# Altium schematic sheet Test_disposable.SchDoc
size A4; DrawnBy: Philip Rowse
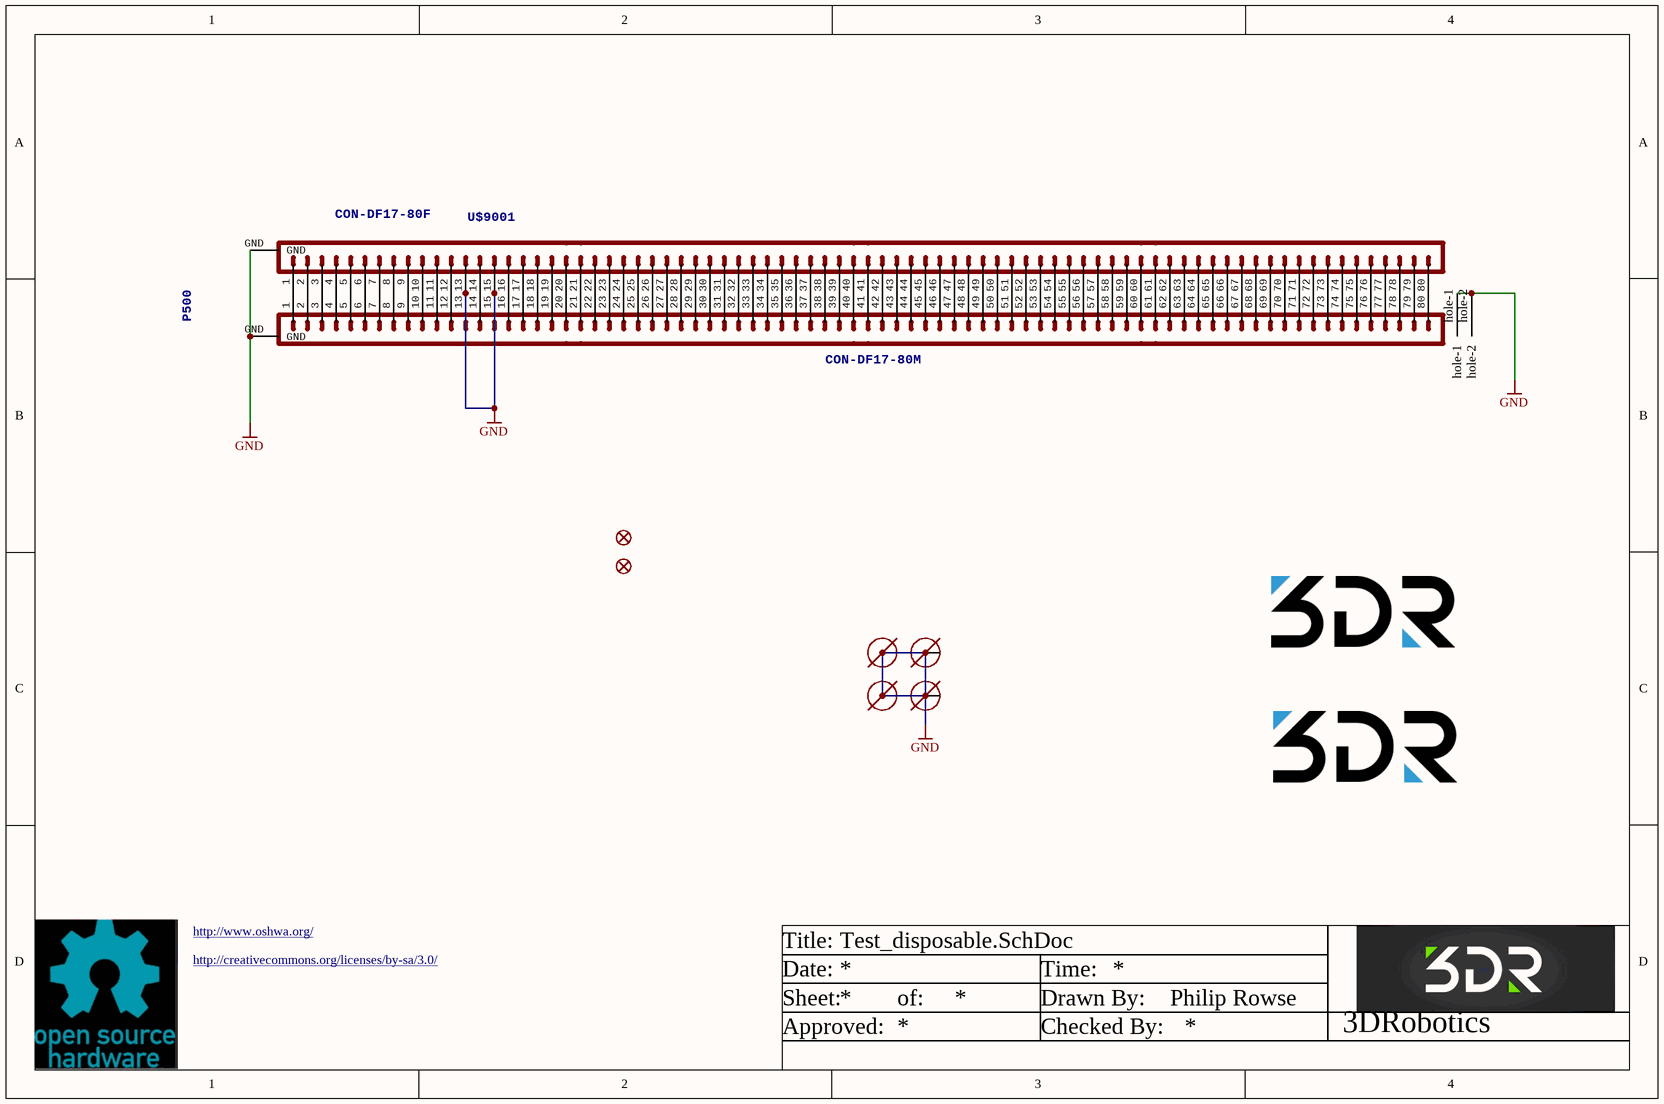
[diagram p0: Test_disposable.SchDoc]

## Parts
3DR_Logo  DO NOT PLACE  [3DR_smaller]  (value not drawn)
3DR_Logo_2  DO NOT PLACE  [3DR_AU]  (value not drawn)
JP400  FIDUCIAL1.5X3  [FIDUCIAL-1.5X3]  (value not drawn)
JP401  FIDUCIAL1.5X3  [FIDUCIAL-1.5X3]  (value not drawn)
M3_MOUNT911  MOUNT-HOLE1.8MM  [MOUNT-HOLE1.8]  (value not drawn)
M3_MOUNT912  MOUNT-HOLE1.8MM  [MOUNT-HOLE1.8]  (value not drawn)
M3_MOUNT913  MOUNT-HOLE1.8MM  [MOUNT-HOLE1.8]  (value not drawn)
M3_MOUNT914  MOUNT-HOLE1.8MM  [MOUNT-HOLE1.8]  (value not drawn)
P500  CON-DF17-80M  [CON-DF17-80M]
U$9001  CON-DF17-80F  [CON-DF17-80F]

## Nets
GND: M3_MOUNT911.1 M3_MOUNT912.1 M3_MOUNT913.1 M3_MOUNT914.1 P500.13 P500.15 P500.GND P500.hole-1 P500.hole-2 U$9001.13 U$9001.15 U$9001.GND
NetP500_1: P500.1 U$9001.1
NetP500_2: P500.2 U$9001.2
NetP500_3: P500.3 U$9001.3
NetP500_4: P500.4 U$9001.4
NetP500_5: P500.5 U$9001.5
NetP500_6: P500.6 U$9001.6
NetP500_7: P500.7 U$9001.7
NetP500_8: P500.8 U$9001.8
NetP500_9: P500.9 U$9001.9
NetP500_10: P500.10 U$9001.10
NetP500_11: P500.11 U$9001.11
NetP500_12: P500.12 U$9001.12
NetP500_14: P500.14 U$9001.14
NetP500_16: P500.16 U$9001.16
NetP500_17: P500.17 U$9001.17
NetP500_18: P500.18 U$9001.18
NetP500_19: P500.19 U$9001.19
NetP500_20: P500.20 U$9001.20
NetP500_21: P500.21 U$9001.21
NetP500_22: P500.22 U$9001.22
NetP500_23: P500.23 U$9001.23
NetP500_24: P500.24 U$9001.24
NetP500_25: P500.25 U$9001.25
NetP500_26: P500.26 U$9001.26
NetP500_27: P500.27 U$9001.27
NetP500_28: P500.28 U$9001.28
NetP500_29: P500.29 U$9001.29
NetP500_30: P500.30 U$9001.30
NetP500_31: P500.31 U$9001.31
NetP500_32: P500.32 U$9001.32
NetP500_33: P500.33 U$9001.33
NetP500_34: P500.34 U$9001.34
NetP500_35: P500.35 U$9001.35
NetP500_36: P500.36 U$9001.36
NetP500_37: P500.37 U$9001.37
NetP500_38: P500.38 U$9001.38
NetP500_39: P500.39 U$9001.39
NetP500_40: P500.40 U$9001.40
NetP500_41: P500.41 U$9001.41
NetP500_42: P500.42 U$9001.42
NetP500_43: P500.43 U$9001.43
NetP500_44: P500.44 U$9001.44
NetP500_45: P500.45 U$9001.45
NetP500_46: P500.46 U$9001.46
NetP500_47: P500.47 U$9001.47
NetP500_48: P500.48 U$9001.48
NetP500_49: P500.49 U$9001.49
NetP500_50: P500.50 U$9001.50
NetP500_51: P500.51 U$9001.51
NetP500_52: P500.52 U$9001.52
NetP500_53: P500.53 U$9001.53
NetP500_54: P500.54 U$9001.54
NetP500_55: P500.55 U$9001.55
NetP500_56: P500.56 U$9001.56
NetP500_57: P500.57 U$9001.57
NetP500_58: P500.58 U$9001.58
NetP500_59: P500.59 U$9001.59
NetP500_60: P500.60 U$9001.60
NetP500_61: P500.61 U$9001.61
NetP500_62: P500.62 U$9001.62
NetP500_63: P500.63 U$9001.63
NetP500_64: P500.64 U$9001.64
NetP500_65: P500.65 U$9001.65
NetP500_66: P500.66 U$9001.66
NetP500_67: P500.67 U$9001.67
NetP500_68: P500.68 U$9001.68
NetP500_69: P500.69 U$9001.69
NetP500_70: P500.70 U$9001.70
NetP500_71: P500.71 U$9001.71
NetP500_72: P500.72 U$9001.72
NetP500_73: P500.73 U$9001.73
NetP500_74: P500.74 U$9001.74
NetP500_75: P500.75 U$9001.75
NetP500_76: P500.76 U$9001.76
NetP500_77: P500.77 U$9001.77
NetP500_78: P500.78 U$9001.78
NetP500_79: P500.79 U$9001.79
NetP500_80: P500.80 U$9001.80

## Notes on the sheet
- http://www.oshwa.org/
- http://creativecommons.org/licenses/by-sa/3.0/
- Title:
- Date:
- Time:
- Sheet:
- Approved:
- of:
- Drawn By:
- Checked By:
- 3DRobotics

## Library data of the parts
3DR_Logo 3DR_Logo_2 = 3DR_LOGO
JP400 JP401 = FIDUCIAL1.5X3: <b>Fiducial Alignment Points</b> / Various fiducial points for machine vision alignment.; BOM: EXCLUDE; PARTNO: *
P500 = CON-DF17-80M: Connector, Header, 80Pos, .5MM, DUAL, SMD, Au; 3DR_PARTNO: PRT0436; Supplier 1: Digi-Key
U$9001 = CON-DF17-80F: CONN RECEPT 80POS .5MM SMD W/FIT; 3DR_PARTNO: ECM0518; PARTNO: DF17(3.0H)-80DS-0.5V(57); Supplier 1: Digi-Key